# Altium schematic sheet relays1.SchDoc
size A4
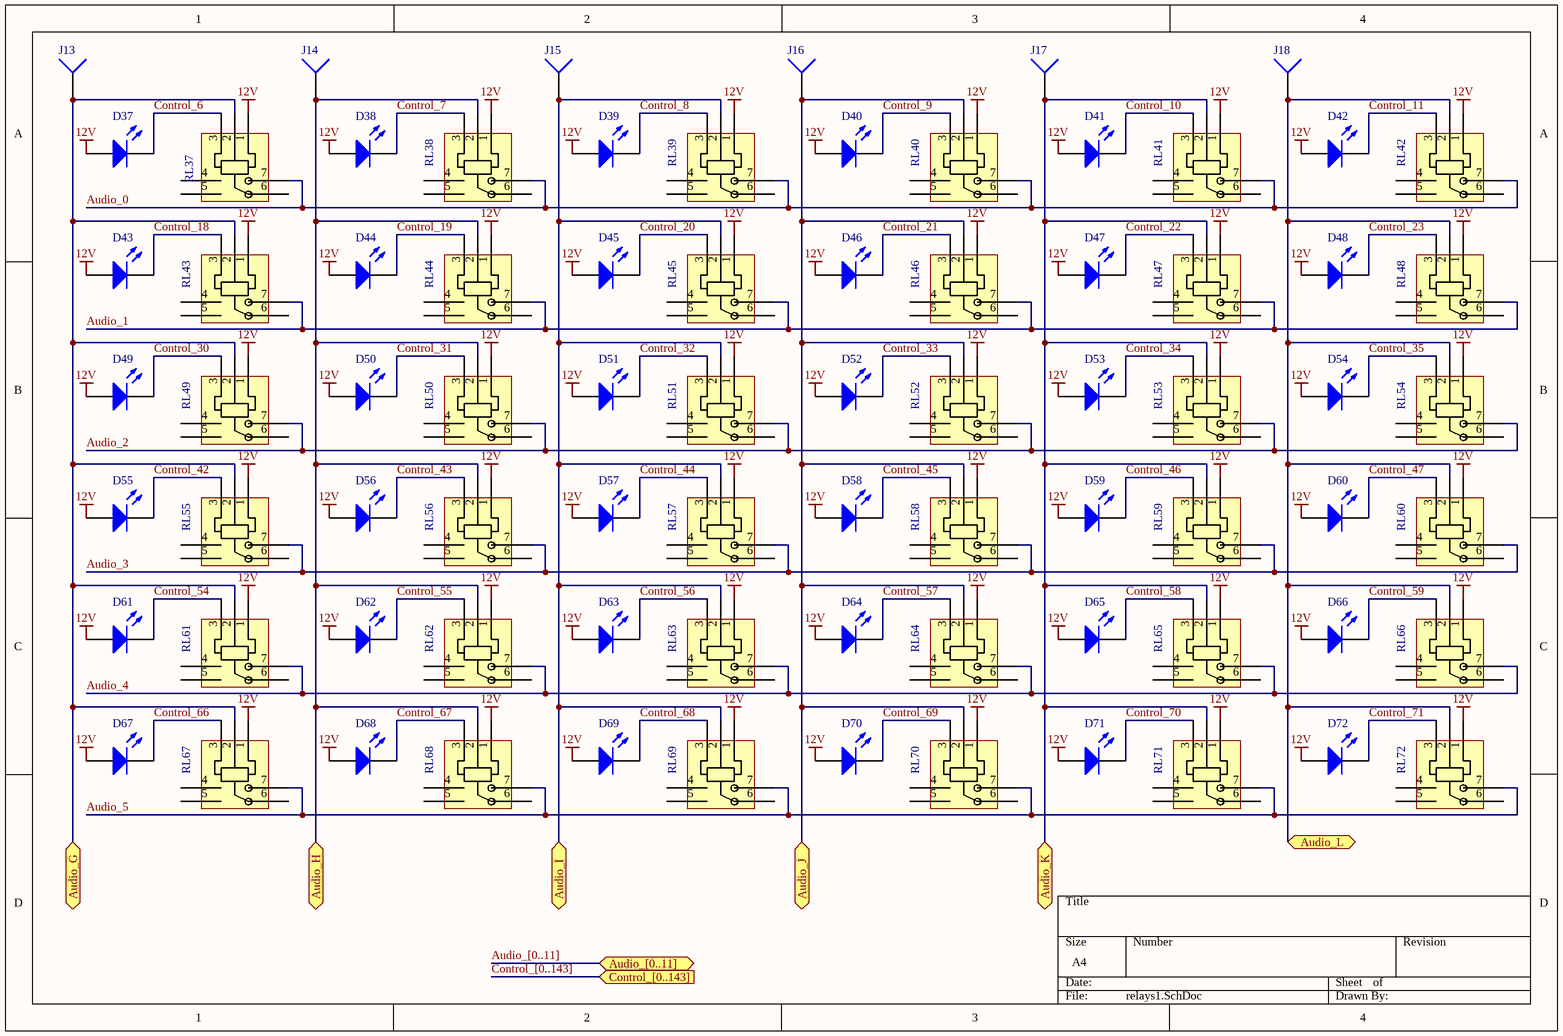
[diagram p0: relays1.SchDoc]

## Parts
D37  LED0  [LED_round_5mm]  (value not drawn)
D38  LED0  [LED_round_5mm]  (value not drawn)
D39  LED0  [LED_round_5mm]  (value not drawn)
D40  LED0  [LED_round_5mm]  (value not drawn)
D41  LED0  [LED_round_5mm]  (value not drawn)
D42  LED0  [LED_round_5mm]  (value not drawn)
D43  LED0  [LED_round_5mm]  (value not drawn)
D44  LED0  [LED_round_5mm]  (value not drawn)
D45  LED0  [LED_round_5mm]  (value not drawn)
D46  LED0  [LED_round_5mm]  (value not drawn)
D47  LED0  [LED_round_5mm]  (value not drawn)
D48  LED0  [LED_round_5mm]  (value not drawn)
D49  LED0  [LED_round_5mm]  (value not drawn)
D50  LED0  [LED_round_5mm]  (value not drawn)
D51  LED0  [LED_round_5mm]  (value not drawn)
D52  LED0  [LED_round_5mm]  (value not drawn)
D53  LED0  [LED_round_5mm]  (value not drawn)
D54  LED0  [LED_round_5mm]  (value not drawn)
D55  LED0  [LED_round_5mm]  (value not drawn)
D56  LED0  [LED_round_5mm]  (value not drawn)
D57  LED0  [LED_round_5mm]  (value not drawn)
D58  LED0  [LED_round_5mm]  (value not drawn)
D59  LED0  [LED_round_5mm]  (value not drawn)
D60  LED0  [LED_round_5mm]  (value not drawn)
D61  LED0  [LED_round_5mm]  (value not drawn)
D62  LED0  [LED_round_5mm]  (value not drawn)
D63  LED0  [LED_round_5mm]  (value not drawn)
D64  LED0  [LED_round_5mm]  (value not drawn)
D65  LED0  [LED_round_5mm]  (value not drawn)
D66  LED0  [LED_round_5mm]  (value not drawn)
D67  LED0  [LED_round_5mm]  (value not drawn)
D68  LED0  [LED_round_5mm]  (value not drawn)
D69  LED0  [LED_round_5mm]  (value not drawn)
D70  LED0  [LED_round_5mm]  (value not drawn)
D71  LED0  [LED_round_5mm]  (value not drawn)
D72  LED0  [LED_round_5mm]  (value not drawn)
J13  Audio  [Conn_1_2x4]  (value not drawn)
J14  Audio  [Conn_1_2x4]  (value not drawn)
J15  Audio  [Conn_1_2x4]  (value not drawn)
J16  Audio  [Conn_1_2x4]  (value not drawn)
J17  Audio  [Conn_1_2x4]  (value not drawn)
J18  Audio  [Conn_1_2x4]  (value not drawn)
RL37  Relay  [Relay_FRA3]  (value not drawn)
RL38  Relay  [Relay_FRA3]  (value not drawn)
RL39  Relay  [Relay_FRA3]  (value not drawn)
RL40  Relay  [Relay_FRA3]  (value not drawn)
RL41  Relay  [Relay_FRA3]  (value not drawn)
RL42  Relay  [Relay_FRA3]  (value not drawn)
RL43  Relay  [Relay_FRA3]  (value not drawn)
RL44  Relay  [Relay_FRA3]  (value not drawn)
RL45  Relay  [Relay_FRA3]  (value not drawn)
RL46  Relay  [Relay_FRA3]  (value not drawn)
RL47  Relay  [Relay_FRA3]  (value not drawn)
RL48  Relay  [Relay_FRA3]  (value not drawn)
RL49  Relay  [Relay_FRA3]  (value not drawn)
RL50  Relay  [Relay_FRA3]  (value not drawn)
RL51  Relay  [Relay_FRA3]  (value not drawn)
RL52  Relay  [Relay_FRA3]  (value not drawn)
RL53  Relay  [Relay_FRA3]  (value not drawn)
RL54  Relay  [Relay_FRA3]  (value not drawn)
RL55  Relay  [Relay_FRA3]  (value not drawn)
RL56  Relay  [Relay_FRA3]  (value not drawn)
RL57  Relay  [Relay_FRA3]  (value not drawn)
RL58  Relay  [Relay_FRA3]  (value not drawn)
RL59  Relay  [Relay_FRA3]  (value not drawn)
RL60  Relay  [Relay_FRA3]  (value not drawn)
RL61  Relay  [Relay_FRA3]  (value not drawn)
RL62  Relay  [Relay_FRA3]  (value not drawn)
RL63  Relay  [Relay_FRA3]  (value not drawn)
RL64  Relay  [Relay_FRA3]  (value not drawn)
RL65  Relay  [Relay_FRA3]  (value not drawn)
RL66  Relay  [Relay_FRA3]  (value not drawn)
RL67  Relay  [Relay_FRA3]  (value not drawn)
RL68  Relay  [Relay_FRA3]  (value not drawn)
RL69  Relay  [Relay_FRA3]  (value not drawn)
RL70  Relay  [Relay_FRA3]  (value not drawn)
RL71  Relay  [Relay_FRA3]  (value not drawn)
RL72  Relay  [Relay_FRA3]  (value not drawn)

## Ports
Audio_[0..11] (bidir), Audio_G (bidir), Audio_H (bidir), Audio_I (bidir), Audio_J (bidir), Audio_K (bidir), Audio_L (bidir), Control_[0..143] (in)

## Nets
12V: D37.1(A) D38.1(A) D39.1(A) D40.1(A) D41.1(A) D42.1(A) D43.1(A) D44.1(A) D45.1(A) D46.1(A) D47.1(A) D48.1(A) D49.1(A) D50.1(A) D51.1(A) D52.1(A) D53.1(A) D54.1(A) D55.1(A) D56.1(A) D57.1(A) D58.1(A) D59.1(A) D60.1(A) D61.1(A) D62.1(A) D63.1(A) D64.1(A) D65.1(A) D66.1(A) D67.1(A) D68.1(A) D69.1(A) D70.1(A) D71.1(A) D72.1(A) RL37.1 RL38.1 RL39.1 RL40.1 RL41.1 RL42.1 RL43.1 RL44.1 RL45.1 RL46.1 RL47.1 RL48.1 RL49.1 RL50.1 RL51.1 RL52.1 RL53.1 RL54.1 RL55.1 RL56.1 RL57.1 RL58.1 RL59.1 RL60.1 RL61.1 RL62.1 RL63.1 RL64.1 RL65.1 RL66.1 RL67.1 RL68.1 RL69.1 RL70.1 RL71.1 RL72.1
Audio_0: RL37.7 RL38.7 RL39.7 RL40.7 RL41.7 RL42.7
Audio_1: RL43.7 RL44.7 RL45.7 RL46.7 RL47.7 RL48.7
Audio_2: RL49.7 RL50.7 RL51.7 RL52.7 RL53.7 RL54.7
Audio_3: RL55.7 RL56.7 RL57.7 RL58.7 RL59.7 RL60.7
Audio_4: RL61.7 RL62.7 RL63.7 RL64.7 RL65.7 RL66.7
Audio_5: RL67.7 RL68.7 RL69.7 RL70.7 RL71.7 RL72.7
Audio_G: J13.1 RL37.2 RL43.2 RL49.2 RL55.2 RL61.2 RL67.2 ; port Audio_G
Audio_H: J14.1 RL38.2 RL44.2 RL50.2 RL56.2 RL62.2 RL68.2 ; port Audio_H
Audio_I: J15.1 RL39.2 RL45.2 RL51.2 RL57.2 RL63.2 RL69.2 ; port Audio_I
Audio_J: J16.1 RL40.2 RL46.2 RL52.2 RL58.2 RL64.2 RL70.2 ; port Audio_J
Audio_K: J17.1 RL41.2 RL47.2 RL53.2 RL59.2 RL65.2 RL71.2 ; port Audio_K
Audio_L: J18.1 RL42.2 RL48.2 RL54.2 RL60.2 RL66.2 RL72.2 ; port Audio_L
Control_6: D37.2(K) RL37.3
Control_7: D38.2(K) RL38.3
Control_8: D39.2(K) RL39.3
Control_9: D40.2(K) RL40.3
Control_10: D41.2(K) RL41.3
Control_11: D42.2(K) RL42.3
Control_18: D43.2(K) RL43.3
Control_19: D44.2(K) RL44.3
Control_20: D45.2(K) RL45.3
Control_21: D46.2(K) RL46.3
Control_22: D47.2(K) RL47.3
Control_23: D48.2(K) RL48.3
Control_30: D49.2(K) RL49.3
Control_31: D50.2(K) RL50.3
Control_32: D51.2(K) RL51.3
Control_33: D52.2(K) RL52.3
Control_34: D53.2(K) RL53.3
Control_35: D54.2(K) RL54.3
Control_42: D55.2(K) RL55.3
Control_43: D56.2(K) RL56.3
Control_44: D57.2(K) RL57.3
Control_45: D58.2(K) RL58.3
Control_46: D59.2(K) RL59.3
Control_47: D60.2(K) RL60.3
Control_54: D61.2(K) RL61.3
Control_55: D62.2(K) RL62.3
Control_56: D63.2(K) RL63.3
Control_57: D64.2(K) RL64.3
Control_58: D65.2(K) RL65.3
Control_59: D66.2(K) RL66.3
Control_66: D67.2(K) RL67.3
Control_67: D68.2(K) RL68.3
Control_68: D69.2(K) RL69.3
Control_69: D70.2(K) RL70.3
Control_70: D71.2(K) RL71.3
Control_71: D72.2(K) RL72.3

Not connected (* = marked no-connect by the designer): RL37 4 5 6; RL38 4 5 6; RL39 4 5 6; RL40 4 5 6; RL41 4 5 6; RL42 4 5 6; RL43 4 5 6; RL44 4 5 6; RL45 4 5 6; RL46 4 5 6; RL47 4 5 6; RL48 4 5 6; RL49 4 5 6; RL50 4 5 6; RL51 4 5 6; RL52 4 5 6; RL53 4 5 6; RL54 4 5 6; RL55 4 5 6; RL56 4 5 6; RL57 4 5 6; RL58 4 5 6; RL59 4 5 6; RL60 4 5 6; RL61 4 5 6; RL62 4 5 6; RL63 4 5 6; RL64 4 5 6; RL65 4 5 6; RL66 4 5 6; RL67 4 5 6; RL68 4 5 6; RL69 4 5 6; RL70 4 5 6; RL71 4 5 6; RL72 4 5 6

## Buses and harness runs
bus Audio_[0..11] = port Audio_[0..11]
bus Control_[0..143] = port Control_[0..143]

## Library data of the parts
D37-D72 = LED0: Typical INFRARED GaAs LED; Published: 8-Jun-2000; LatestRevisionDate: 08-Jul-2005; LatestRevisionNote: Mech Layer 1 removed.; PackageReference: LED-0; Publisher: Altium Limited; PackageDescription: LED; 2 Leads
J13-J18 = Socket: LatestRevisionDate: 17-Jul-2002; LatestRevisionNote: Re-released for DXP Platform.; Publisher: Altium Limited
RL37-RL72 = Relay_FRA3: Miniature power relay; Part number: FRA3C-DC12